# Altium schematic sheet PiPico_Pinout.SchDoc
size A4; SheetNumber: 1; SheetTotal: 1
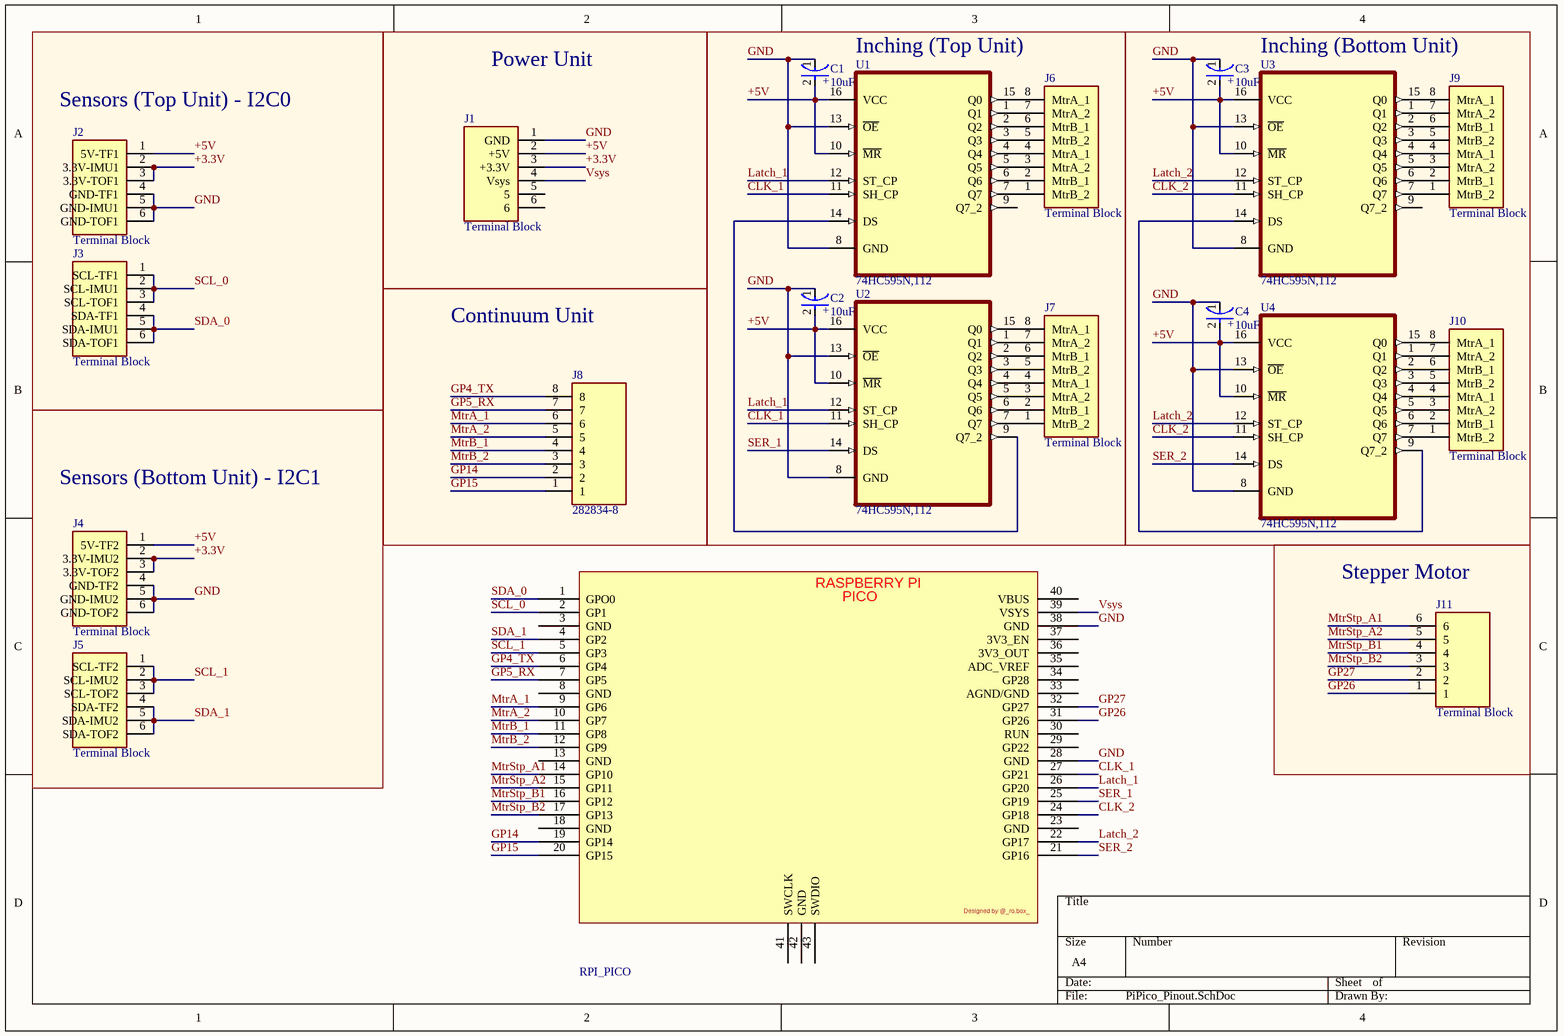
[diagram p0: PiPico_Pinout.SchDoc]

## Parts
C1  10uF  [FP-TAP106K016SCS-MFG]
C2  10uF  [FP-TAP106K016SCS-MFG]
C3  10uF  [FP-TAP106K016SCS-MFG]
C4  10uF  [FP-TAP106K016SCS-MFG]
J1  Terminal Block  [TE_282834-6]
J2  Terminal Block  [TE_282834-6]
J3  Terminal Block  [TE_282834-6]
J4  Terminal Block  [TE_282834-6]
J5  Terminal Block  [TE_282834-6]
J6  Terminal Block  [TE_282834-8]
J7  Terminal Block  [TE_282834-8]
J8  282834-8  [TE_282834-8]
J9  Terminal Block  [TE_282834-8]
J10  Terminal Block  [TE_282834-8]
J11  Terminal Block  [TE_282834-6]
RPI_PICO  RPI_PICO  [RPI PICO 2020]  (value not drawn)
U1  74HC595N,112  [DIP254P762X420-16]
U2  74HC595N,112  [DIP254P762X420-16]
U3  74HC595N,112  [DIP254P762X420-16]
U4  74HC595N,112  [DIP254P762X420-16]

## Blocks framed on the sheet
Sensors (Top Unit) - I2C0: J2 J3
Power Unit: J1
Inching (Top Unit): C1 C2 J6 J7 U1 U2
Inching (Bottom Unit): C3 C4 J9 J10 U3 U4
Continuum Unit: J8
Sensors (Bottom Unit) - I2C1: J4 J5
Stepper Motor: J11

## Nets
+3.3V: J1.3(+3.3V) J2.2(3.3V-IMU1) J2.3(3.3V-TOF1) J4.2(3.3V-IMU2) J4.3(3.3V-TOF2)
+5V: C1.2(A) C2.2(A) C3.2(A) C4.2(A) J1.2(+5V) J2.1(5V-TF1) J4.1(5V-TF2) U1.10(~{MR}) U1.16(VCC) U2.10(~{MR}) U2.16(VCC) U3.10(~{MR}) U3.16(VCC) U4.10(~{MR}) U4.16(VCC)
CLK_1: RPI_PICO.27(GP21) U1.11(SH_CP) U2.11(SH_CP)
CLK_2: RPI_PICO.24(GP18) U3.11(SH_CP) U4.11(SH_CP)
GND: C1.1(C) C2.1(C) C3.1(C) C4.1(C) J1.1(GND) J2.4(GND-TF1) J2.5(GND-IMU1) J2.6(GND-TOF1) J4.4(GND-TF2) J4.5(GND-IMU2) J4.6(GND-TOF2) RPI_PICO.28(GND) RPI_PICO.38(GND) U1.8(GND) U1.13(~{OE}) U2.8(GND) U2.13(~{OE}) U3.8(GND) U3.13(~{OE}) U4.8(GND) U4.13(~{OE})
GP4_TX: J8.8 RPI_PICO.6(GP4)
GP5_RX: J8.7 RPI_PICO.7(GP5)
GP14: J8.2 RPI_PICO.19(GP14)
GP15: J8.1 RPI_PICO.20(GP15)
GP26: J11.1 RPI_PICO.31(GP26)
GP27: J11.2 RPI_PICO.32(GP27)
Latch_1: RPI_PICO.26(GP20) U1.12(ST_CP) U2.12(ST_CP)
Latch_2: RPI_PICO.22(GP17) U3.12(ST_CP) U4.12(ST_CP)
MtrA_1: J8.6 RPI_PICO.9(GP6)
MtrA_2: J8.5 RPI_PICO.10(GP7)
MtrB_1: J8.4 RPI_PICO.11(GP8)
MtrB_2: J8.3 RPI_PICO.12(GP9)
MtrStp_A1: J11.6 RPI_PICO.14(GP10)
MtrStp_A2: J11.5 RPI_PICO.15(GP11)
MtrStp_B1: J11.4 RPI_PICO.16(GP12)
MtrStp_B2: J11.3 RPI_PICO.17(GP13)
SCL_0: J3.1(SCL-TF1) J3.2(SCL-IMU1) J3.3(SCL-TOF1) RPI_PICO.2(GP1)
SCL_1: J5.1(SCL-TF2) J5.2(SCL-IMU2) J5.3(SCL-TOF2) RPI_PICO.5(GP3)
SDA_0: J3.4(SDA-TF1) J3.5(SDA-IMU1) J3.6(SDA-TOF1) RPI_PICO.1(GPO0)
SDA_1: J5.4(SDA-TF2) J5.5(SDA-IMU2) J5.6(SDA-TOF2) RPI_PICO.4(GP2)
SER_1: RPI_PICO.25(GP19) U2.14(DS)
SER_2: RPI_PICO.21(GP16) U4.14(DS)
Vsys: J1.4(Vsys) RPI_PICO.39(VSYS)
NetJ6_1: J6.1(MtrB_2) U1.7(Q7)
NetJ6_2: J6.2(MtrB_1) U1.6(Q6)
NetJ6_3: J6.3(MtrA_2) U1.5(Q5)
NetJ6_4: J6.4(MtrA_1) U1.4(Q4)
NetJ6_5: J6.5(MtrB_2) U1.3(Q3)
NetJ6_6: J6.6(MtrB_1) U1.2(Q2)
NetJ6_7: J6.7(MtrA_2) U1.1(Q1)
NetJ6_8: J6.8(MtrA_1) U1.15(Q0)
NetJ7_1: J7.1(MtrB_2) U2.7(Q7)
NetJ7_2: J7.2(MtrB_1) U2.6(Q6)
NetJ7_3: J7.3(MtrA_2) U2.5(Q5)
NetJ7_4: J7.4(MtrA_1) U2.4(Q4)
NetJ7_5: J7.5(MtrB_2) U2.3(Q3)
NetJ7_6: J7.6(MtrB_1) U2.2(Q2)
NetJ7_7: J7.7(MtrA_2) U2.1(Q1)
NetJ7_8: J7.8(MtrA_1) U2.15(Q0)
NetJ9_1: J9.1(MtrB_2) U3.7(Q7)
NetJ9_2: J9.2(MtrB_1) U3.6(Q6)
NetJ9_3: J9.3(MtrA_2) U3.5(Q5)
NetJ9_4: J9.4(MtrA_1) U3.4(Q4)
NetJ9_5: J9.5(MtrB_2) U3.3(Q3)
NetJ9_6: J9.6(MtrB_1) U3.2(Q2)
NetJ9_7: J9.7(MtrA_2) U3.1(Q1)
NetJ9_8: J9.8(MtrA_1) U3.15(Q0)
NetJ10_1: J10.1(MtrB_2) U4.7(Q7)
NetJ10_2: J10.2(MtrB_1) U4.6(Q6)
NetJ10_3: J10.3(MtrA_2) U4.5(Q5)
NetJ10_4: J10.4(MtrA_1) U4.4(Q4)
NetJ10_5: J10.5(MtrB_2) U4.3(Q3)
NetJ10_6: J10.6(MtrB_1) U4.2(Q2)
NetJ10_7: J10.7(MtrA_2) U4.1(Q1)
NetJ10_8: J10.8(MtrA_1) U4.15(Q0)
NetU1_14: U1.14(DS) U2.9(Q7_2)
NetU3_14: U3.14(DS) U4.9(Q7_2)

Not connected (* = marked no-connect by the designer): J1 5 6; RPI_PICO 3(GND) 8(GND) 13(GND) 18(GND) 23(GND) 29(GP22) 30(RUN) 33(AGND/GND) 34(GP28) 35(ADC_VREF) 36(3V3_OUT) 37(3V3_EN) 40(VBUS) 41(SWCLK) 42(GND) 43(SWDIO); U1 9(Q7_2); U3 9(Q7_2)

## Notes on the sheet
- (in symbol CMP-04424-000616-1) +
- (in symbol RPI_PICO) RASPBERRY PI; PICO; Designed by @_ro.box_

## Library data of the parts
C1-C4 = CMP-04424-000616-1: CAP TANT 10UF 10% 16V RADIAL; Dissipation Factor: 8%; Dielectric Material: Tantalum; Leakage Current: 1.2uA; Polarity: Polar; Life (Hours): 1000Hour; ESR (Equivalent Series Resistance): 3.2R; Lead Diameter: 0.5mm; Packaging: Bulk; Min Operating Temperature: -55°C; RoHS Compliant: Yes; Construction: RADIAL; Length: 9mm; Number of Pins: 2; Height - Seated (Max): 0.354inch; Termination: Radial; Tolerance: 10%; Case/Package: Dipped; Voltage Rating (DC): 16V; Voltage Rating: 16V; Lead Pitch: 2.5mm; Size: 9mm; Voltage: 16V; Lead Free: Lead Free; Mount: Through Hole; Height: 9mm; Max Operating Temperature: 125°C; Features: General Purpose; Diameter: 5mm; Radiation Hardening: No; Package Quantity: 1000; Series: TAP; Capacitance: 10uF
J1-J5 J11 = 282834-6: MF: {'manufacturer': 'TE Connectivity'}; Availability: Unavailable; MP: 282834-6; Price: None; Package: None; Value: *
J6-J10 = 282834-8: Buchanan; Conn; Term Blk; PCB; 8; 2.54mm; Front; 30-16 AWG; Green; 10 A; 150 V; MF: TE Connectivity; SnapEDA_Link: https://www.snapeda.com/parts/282834-8/TE+Connectivity+AMP+Connectors/view-part/?ref=snap; Purchase-URL: https://pricing.snapeda.com/search/part/282834-8/?ref=eda; Value: *; Digi-Key_Part_Number: A98338-ND; Package: None; Check_prices: https://www.snapeda.com/parts/282834-8/TE+Connectivity+AMP+Connectors/view-part/?ref=eda; MP: 282834-8
U1-U4 = 74HC595N,112: Shift Shift Register 1 Element 8 Bit 16-DIP; MF: NXP USA; Purchase-URL: https://pricing.snapeda.com/search/part/74HC595N,112/?ref=eda; Package: SOT38-4-16 Nexperia; Value: *; Check_prices: https://www.snapeda.com/parts/74HC595N,112/NXP+USA+Inc./view-part/?ref=eda; SnapEDA_Link: https://www.snapeda.com/parts/74HC595N,112/NXP+USA+Inc./view-part/?ref=snap; Availability: In Stock; Price: None; MP: 74HC595N,112